# Altium schematic sheet Connections.SchDoc
size A4; SheetNumber: 1; SheetTotal: 2
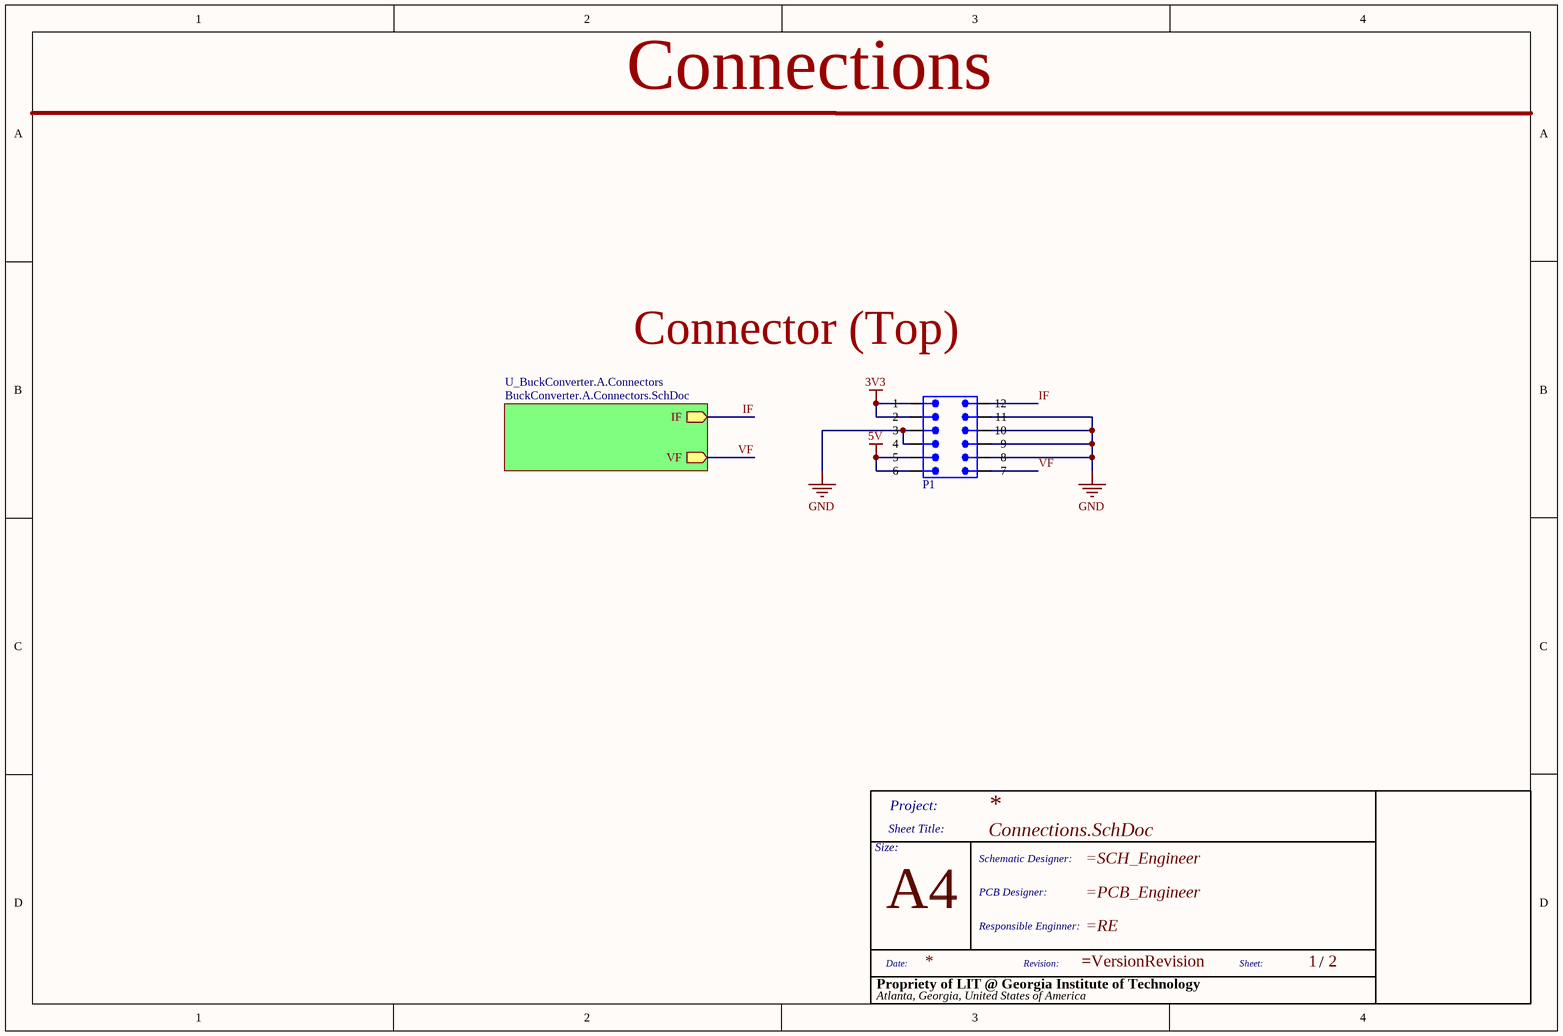
[diagram p0: Connections.SchDoc]

## Parts
*  Size: A4  (hidden comment: TitleBlock)  (graphical)
P1  NPPC062KFMS-RC  [NPPC062KFMS-RC]  (value not drawn)

## Sub-sheets
U_BuckConverter.A.Connectors = BuckConverter.A.Connectors.SchDoc: IF (out), VF (out)

## Nets
3V3: P1.11(2) P1.12(1)
5V: P1.7(6) P1.8(5)
GND: P1.2(11) P1.3(10) P1.4(9) P1.5(8) P1.9(4) P1.10(3)
IF: P1.1(12) ; sheet U_BuckConverter.A.Connectors/IF
VF: P1.6(7) ; sheet U_BuckConverter.A.Connectors/VF

## Notes on the sheet
- Connections
- (near P1) Connector (Top)
- (in symbol TitleBlock) Project:; Sheet Title:; Size:; Schematic Designer:; PCB Designer:; Responsible Enginner:; Date:; Revision:; Sheet:; /; Propriety of LIT @ Georgia Institute of Technology; Atlanta, Georgia, United States of America

## Library data of the parts
* = TitleBlock: Standard Title Block
P1 = BoardToBoard_Top: 12 Position Receptacle Connector 0.100" (2.54mm) Through Hole Gold